# Altium schematic sheet RPI.SchDoc
size A4; SheetNumber: 3; SheetTotal: 4
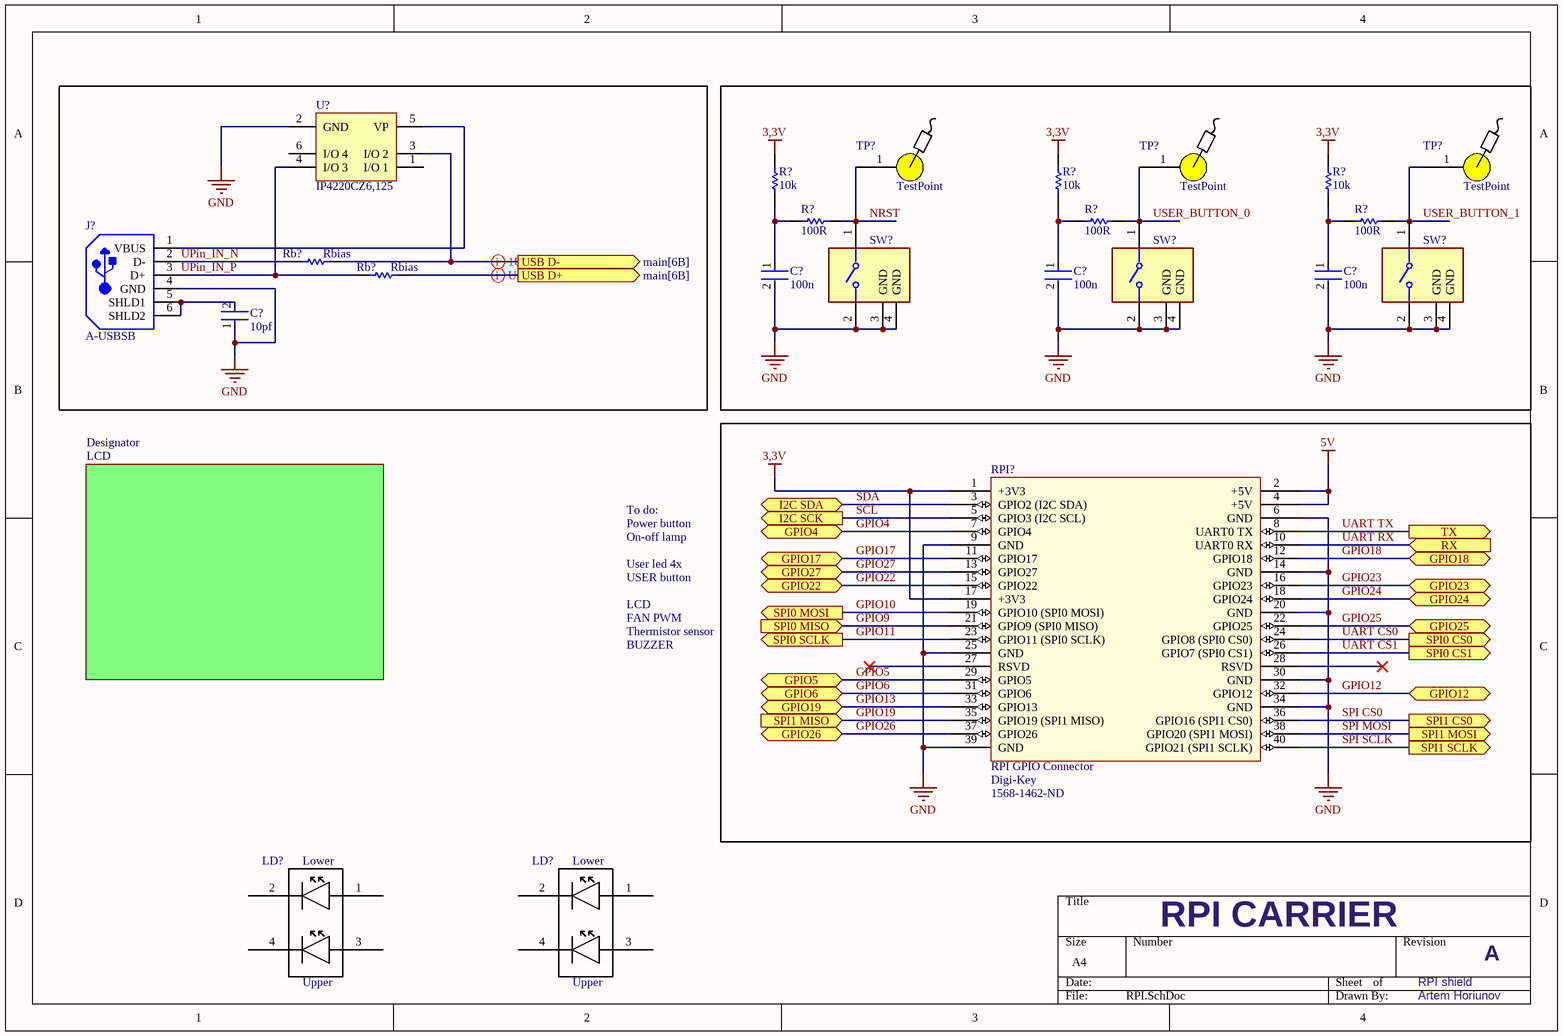
[diagram p0: RPI.SchDoc]

## Parts
(Parts that share a designator on the sheet are numbered #1, #2 ... from top to bottom, then left to right.)
C?#1  100n  [FP-C0603C-CF-MFG]
C?#2  100n  [FP-C0603C-CF-MFG]
C?#3  100n  [FP-C0603C-CF-MFG]
C?#4  10pf  [FP-C0603C-CF-MFG]
J?  A-USBSB  [ASSM-A-USBSB-4_V]
LD?#1  (no value)  [LED_HOLDER]
LD?#2  (no value)  [LED_HOLDER]
R?#1  10k  [RESC0603(1608)_N]
R?#2  10k  [RESC0603(1608)_N]
R?#3  10k  [RESC0603(1608)_N]
R?#4  100R  [RESC0603(1608)_N]
R?#5  100R  [RESC0603(1608)_N]
R?#6  100R  [RESC0603(1608)_N]
Rb?#1  Rbias  [RESC1005X40X25NL05T05]
Rb?#2  Rbias  [RESC1005X40X25NL05T05]
RPI?  RPI GPIO Connector  Supplier 1: Digi-Key  Supplier Part Number 1: 1568-1462-ND  [rpi]
SW?#1  B3F-3122  [FP-B3F-3122-MFG]  (value not drawn)
SW?#2  B3F-3122  [FP-B3F-3122-MFG]  (value not drawn)
SW?#3  B3F-3122  [FP-B3F-3122-MFG]  (value not drawn)
TP?#1  TestPoint  [TestPoint]
TP?#2  TestPoint  [TestPoint]
TP?#3  TestPoint  [TestPoint]
U?  IP4220CZ6,125  [NXP-SOT457_L]

## Sub-sheets
Designator = LCD: no entries

## Ports
GPIO4 (bidir), GPIO5 (bidir), GPIO6 (bidir), GPIO12 (bidir), GPIO17 (bidir), GPIO18 (bidir), GPIO19 (bidir), GPIO22 (bidir), GPIO23 (bidir), GPIO24 (bidir), GPIO25 (bidir), GPIO26 (bidir), GPIO27 (bidir), I2C SCK (out), I2C SDA (bidir), RX (in), SPI0 CS0 (out), SPI0 CS1 (out), SPI0 MISO (in), SPI0 MOSI (out), SPI0 SCLK (out), SPI1 CS0 (out), SPI1 MISO (in), SPI1 MOSI (out), SPI1 SCLK (out), TX (out), USB D+ (out, see main[6B]), USB D- (out, see main[6B])

## Nets
3,3V: R?#1.2 R?#2.2 R?#3.2 RPI?.1(+3V3) RPI?.17(+3V3)
5V: RPI?.2(+5V) RPI?.4(+5V)
GND: C?#1.2 C?#2.2 C?#3.2 C?#4.1 J?.4(GND) RPI?.6(GND) RPI?.9(GND) RPI?.14(GND) RPI?.20(GND) RPI?.25(GND) RPI?.30(GND) RPI?.34(GND) RPI?.39(GND) SW?#1.2 SW?#1.3(GND) SW?#1.4(GND) SW?#2.2 SW?#2.3(GND) SW?#2.4(GND) SW?#3.2 SW?#3.3(GND) SW?#3.4(GND) U?.2(GND)
GPIO4: RPI?.7(GPIO4) ; port GPIO4
GPIO5: RPI?.29(GPIO5) ; port GPIO5
GPIO6: RPI?.31(GPIO6) ; port GPIO6
GPIO9: RPI?.21(GPIO9_(SPI0_MISO)) ; port SPI0 MISO
GPIO10: RPI?.19(GPIO10_(SPI0_MOSI)) ; port SPI0 MOSI
GPIO11: RPI?.23(GPIO11_(SPI0_SCLK)) ; port SPI0 SCLK
GPIO12: RPI?.32(GPIO12) ; port GPIO12
GPIO13: RPI?.33(GPIO13) ; port GPIO19
GPIO17: RPI?.11(GPIO17) ; port GPIO17
GPIO18: RPI?.12(GPIO18) ; port GPIO18
GPIO19: RPI?.35(GPIO19_(SPI1_MISO)) ; port SPI1 MISO
GPIO22: RPI?.15(GPIO22) ; port GPIO22
GPIO23: RPI?.16(GPIO23) ; port GPIO23
GPIO24: RPI?.18(GPIO24) ; port GPIO24
GPIO25: RPI?.22(GPIO25) ; port GPIO25
GPIO26: RPI?.37(GPIO26) ; port GPIO26
GPIO27: RPI?.13(GPIO27) ; port GPIO27
NRST: R?#4.1 SW?#1.1 TP?#1.1
SCL: RPI?.5(GPIO3_(I2C_SCL)) ; port I2C SCK
SDA: RPI?.3(GPIO2_(I2C_SDA)) ; port I2C SDA
SPI CS0: RPI?.36(GPIO16_(SPI1_CS0)) ; port SPI1 CS0
SPI MOSI: RPI?.38(GPIO20_(SPI1_MOSI)) ; port SPI1 MOSI
SPI SCLK: RPI?.40(GPIO21_(SPI1_SCLK)) ; port SPI1 SCLK
UART CS0: RPI?.24(GPIO8_(SPI0_CS0)) ; port SPI0 CS0
UART CS1: RPI?.26(GPIO7_(SPI0_CS1)) ; port SPI0 CS1
UART RX: RPI?.10(UART0_RX) ; port RX
UART TX: RPI?.8(UART0_TX) ; port TX
UPin_IN_N: J?.2(D-) Rb?#1.1
UPin_IN_P: J?.3(D+) Rb?#2.1 U?.4(I/O_3)
USB D+: Rb?#2.2 ; port USB D+
USB D-: Rb?#1.2 U?.3(I/O_2) ; port USB D-
USER_BUTTON_0: R?#5.1 SW?#2.1 TP?#2.1
USER_BUTTON_1: R?#6.1 SW?#3.1 TP?#3.1
NetC?#1_1: C?#1.1 R?#1.1 R?#4.2
NetC?#2_1: C?#2.1 R?#2.1 R?#5.2
NetC?#3_1: C?#3.1 R?#3.1 R?#6.2
NetC?#4_2: C?#4.2 J?.5(SHLD1) J?.6(SHLD2)
NetJ?_1: J?.1(VBUS) U?.5(VP)

Not connected (* = marked no-connect by the designer): LD?#1 1 2 3 4; LD?#2 1 2 3 4; RPI? 27(RSVD)* 28(RSVD)*; U? 1(I/O_1) 6(I/O_4)

## Layout directives
differential pair; differential pair class USB: USB D+, USB D-

## Notes on the sheet
- To do:
- Power button
- On-off lamp
- User led 4x
- USER button
- LCD
- FAN PWM
- Thermistor sensor
- BUZZER
- RPI CARRIER
- RPI shield
- A
- Artem Horiunov
- (in symbol DoubleStack_Side_Led_3mm) Lower; Upper

## Library data of the parts
C?#1-C?#4 = CMP-2006-03061-2: CAP CER 0.1UF 50V X7R 0603; Manufacturer: KEMET; Manufacturer Part Number: C0603C104K5RACTU; Tolerance: 0.1; Temperature Coefficient: 30ppm/°C; Material: Ceramic; Automotive Grade: Grade 1; Value: 0.10 μF; Temperature: -55°C to +125°C; RoHS: TRUE; Temperature Range High: +125°C; Lead Free: Yes; Octopart: https://octopart.com/c0603c104k5ractu-kemet-139244; Digikey Description: CAP CER 0.1UF 50V X7R 0603; Category: Cap; Package: C0603C-CF; ComponentLink2Description: Datasheet; Temperature Range Low: -55°C; Device Class L1: Passive Components; Voltage Rating: 50 V; Automotive: Yes; Device Class L3: Ceramic Capacitors; ComponentLink2URL: https://api.kemet.com/component-edge/download/datasheet/C0603C100J5GACAUTO.pdf; Capacitance: 0.10 μF; Device Class L2: Capacitors; Temperature Characteristic: X7R; Height: 0.87mm
J? = CMP-2000-05874-1: Connector Receptacle, USB Type B, Right Angle, -20 to 85 degC, 4-Pin THD, RoHS, Tray; Manufacturer: ASSMANN WSW; Gender: Female; CAD Drawing: 3DCADModel; Number of Ports: 1; Mounting Type: ThroughHole; Datasheet URL: https://datasheet.ciiva.com/11731/0900766b80da421f-11731321.pdf; Datasheet Version: 12/2009; Manufacturer URL: http://www.assmann.us/; Package Description: 4-Pin Through Hole Device, Body 16.5 x 12.04 mm; Body Orientation: RightAngle; Mounting Technology: ThroughHole; Package Reference: USBSB; Termination Method: Solder
LD?#1 LD?#2 = DoubleStack_Side_Led_3mm
R?#1-R?#6 = CMP-1012-00081-1: 0.1W 5% 0603 (1608 Metric)  SMD; Case-Metric: 1608; Value: 2000.00 Ohm; Case-EIA: 0603; Tolerance: 5 %; Technology: SMT; Power: 0.1 W
Rb?#1 Rb?#2 = CMP-2002-08143-1: Part Number: CRCW040210R0FKED; Manufacturer: Vishay Dale
RPI? = rpi connector: GPIO Header for Raspberry Pi A+/B+/Pi 2/Pi 3 - 2x20; Manufacturer: SparkFun Electronics; Manufacturer Part Number: PRT-14017; Nils Minor: author; nilsminor@web.de: mail; RoHS: RoHS Compliant; Category: Development Boards, Kits, Programmers; Stock 1: 150; Pricing 1: 1=1.84 (EUR); Part Status: Active; Accessory Type: Connector; For Use With/Related Products: Raspberry Pi; ComponentLink1URL: https://cdn.sparkfun.com/datasheets/Dev/RaspberryPi/12313.pdf; ComponentLink1Description: https://cdn.sparkfun.com/datasheets/Dev/RaspberryPi/12313.pdf
SW?#1-SW?#3 = CMP-08834-000053-1: SWITCH TACTILE SPST-NO 0.05A 24V; Max Current Rating: 50mA; Actuator Type: Standard; Ratings: IP00; Number of Poles: 1; Mechanical Life: 300000Cycles; Illumination Type: Non-Illuminated; Switch Function: Off-Mom; Actuator Color: Grey; Contact Resistance: 100mR; Throw Configuration: SPST; Actuator Length: 1.6mm; Switch Travel: 0.25mm; Operating Force: 1.47N; Weight: 0.25g; Voltage Rating (DC): 24V; Contact Plating: Gold; RoHS Compliant: Yes; Contact Material: Gold; Radiation Hardening: No; Packaging: Bulk; Height: 7.4mm; Min Operating Temperature: -25°C; Electrical Life: 300000Cycles; Depth: 7.85mm; Max Voltage Rating (DC): 24V; Mount: Through Hole; Width: 6.25mm; Current Rating: 50mA; Lead Free: Lead Free; Max Operating Temperature: 70°C; Series: B3F; Contact Current Rating: 50mA; Package Quantity: 1000; Termination: PC Pins; Orientation: Right Angle; Length: 7.3mm
U? = CMP-2000-06457-1: Dual USB 2.0 integrated ESD protection, 0 to 5.5 V, -40 to 85 degC, 6-Pin TSOP (SOT457), RoHS, Tape and Reel; Manufacturer: NXP Semiconductors; Product Height (mm): 1mm; Rad Hardened: No; Package Version: 06-03-16, 03/2006; Product Length (mm): 3.1mm; VIN Max: 5.5V; Configuration: Quad; Suppressor Type: DiodeArrays; Number of Channels: 4; VF: 0.7V; Capacitance Value: 1.2pF; Product Depth (mm): 1.7mm; VIN Min: 0V; Leakage Current (Max): 0.1uA; ESD Protection Voltage: 8KV@ContactDisc; Direction Type: Uni-Directional; Manufacturer URL: http://www.nxp.com/; Package Reference: SOT457; Datasheet URL: http://cache.nxp.com/documents/data_sheet/IP4220CZ6.pdf; Operating Temperature Max Deg. C: 85C; Packaging: TapeandReel; Package Description: 6-Pin Thin Small Outline Package, Body 2.9 x 1.5 mm, Pitch 0.95 mm; PartNumber: IP4220CZ6; Mounting Technology: SurfaceMount; Working Voltage (Max): 5.5V; Operating Temperature Min Deg. C: -40C; Working Voltage: 5.5V; Package / Case: TSOP; Package URL: http://www.nxp.com/documents/outline_drawing/sot457_po.pdf; Leakage Current: 0.1uA; Pin Count: 6; Mounting Style: SurfaceMount; Datasheet Version: Rev. 5, 07/2011